# EasyEDA schematic SCH_Trail-Camera_2024-05-14.json
TITLE: Sheet_1; REV: 1.0; Date: 2024-03-28; Sheet: 1/1; Drawn By: thomas37; Company: Your Company
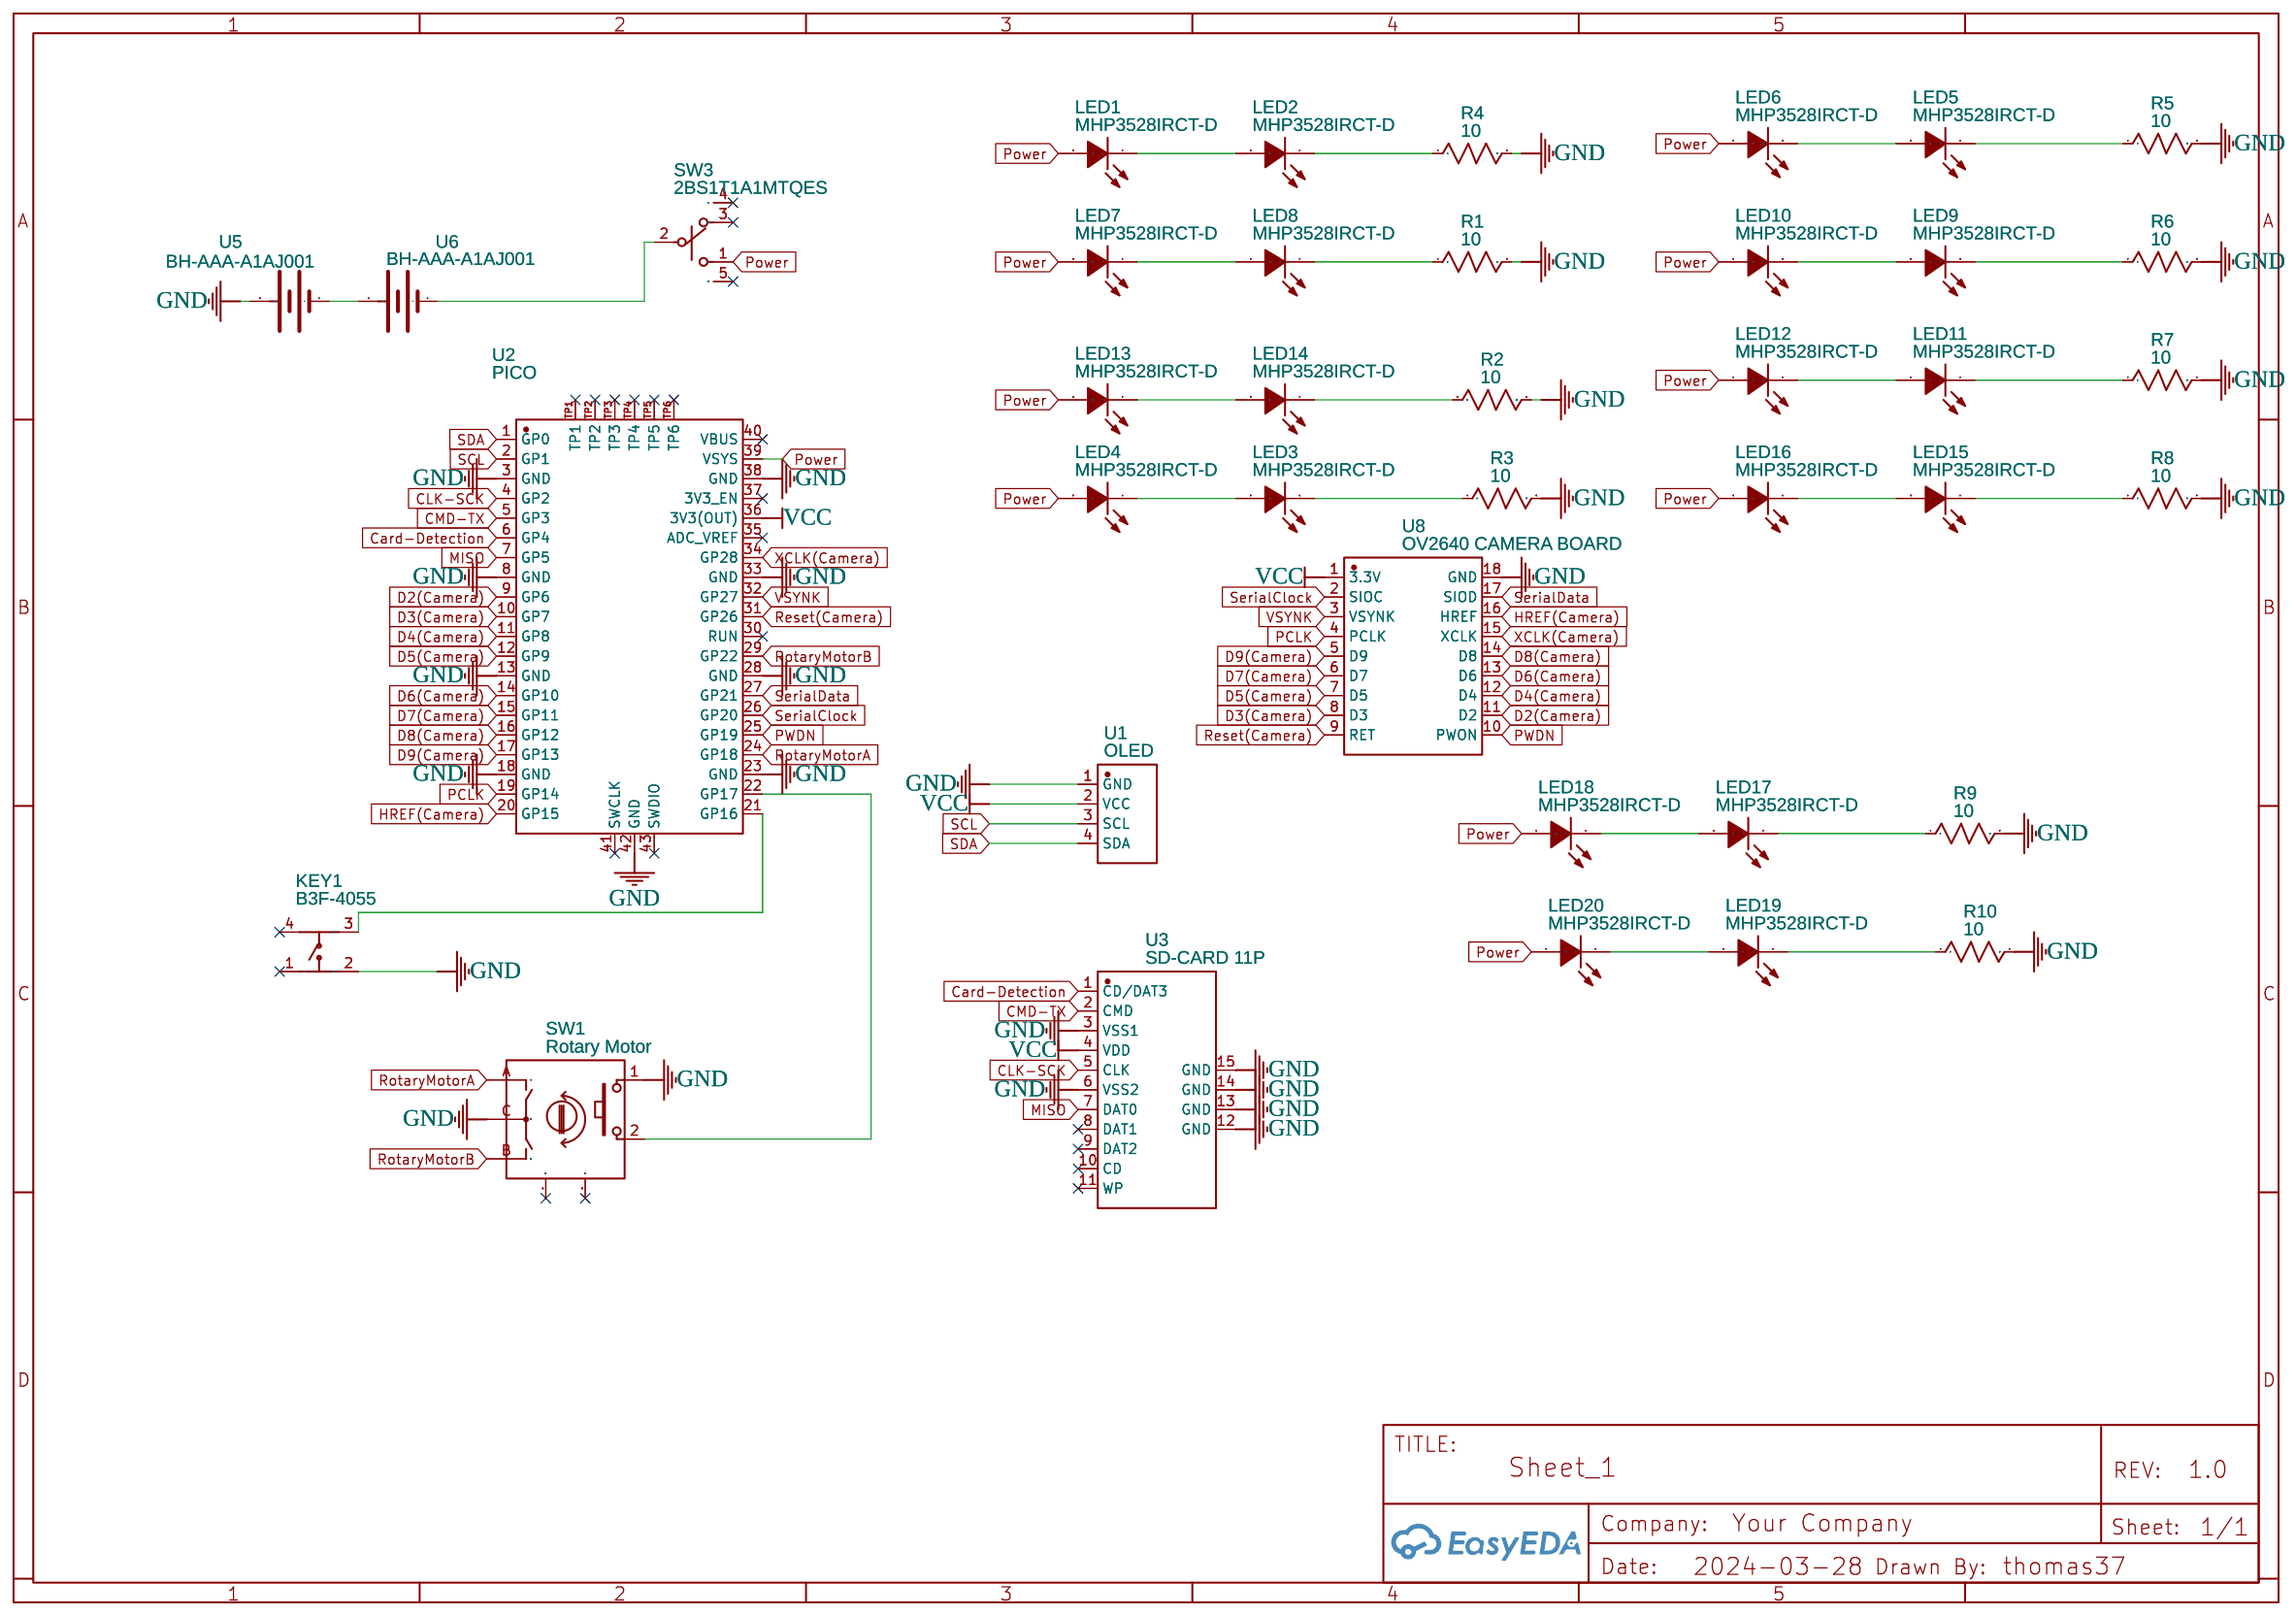
[diagram p0: schematic sheet]

## Parts
KEY1  B3F-4055  [KEY-TH_4P-L12.0-W12.0-P5.00-LS13.4-EH]
LED1  MHP3528IRCT-D  [LED-SMD_L3.2-W2.8-RD]
LED2  MHP3528IRCT-D  [LED-SMD_L3.2-W2.8-RD]
LED3  MHP3528IRCT-D  [LED-SMD_L3.2-W2.8-RD]
LED4  MHP3528IRCT-D  [LED-SMD_L3.2-W2.8-RD]
LED5  MHP3528IRCT-D  [LED-SMD_L3.2-W2.8-RD]
LED6  MHP3528IRCT-D  [LED-SMD_L3.2-W2.8-RD]
LED7  MHP3528IRCT-D  [LED-SMD_L3.2-W2.8-RD]
LED8  MHP3528IRCT-D  [LED-SMD_L3.2-W2.8-RD]
LED9  MHP3528IRCT-D  [LED-SMD_L3.2-W2.8-RD]
LED10  MHP3528IRCT-D  [LED-SMD_L3.2-W2.8-RD]
LED11  MHP3528IRCT-D  [LED-SMD_L3.2-W2.8-RD]
LED12  MHP3528IRCT-D  [LED-SMD_L3.2-W2.8-RD]
LED13  MHP3528IRCT-D  [LED-SMD_L3.2-W2.8-RD]
LED14  MHP3528IRCT-D  [LED-SMD_L3.2-W2.8-RD]
LED15  MHP3528IRCT-D  [LED-SMD_L3.2-W2.8-RD]
LED16  MHP3528IRCT-D  [LED-SMD_L3.2-W2.8-RD]
LED17  MHP3528IRCT-D  [LED-SMD_L3.2-W2.8-RD]
LED18  MHP3528IRCT-D  [LED-SMD_L3.2-W2.8-RD]
LED19  MHP3528IRCT-D  [LED-SMD_L3.2-W2.8-RD]
LED20  MHP3528IRCT-D  [LED-SMD_L3.2-W2.8-RD]
R1  10  [R0603]
R2  10  [R0603]
R3  10  [R0603]
R4  10  [R0603]
R5  10  [R0603]
R6  10  [R0603]
R7  10  [R0603]
R8  10  [R0603]
R9  10  [R0603]
R10  10  [R0603]
SW1  Rotary Motor  [SW-TH_PEC11R-4XXXF-SXXXX]
SW3  2BS1T1A1MTQES  [SW-SMD_2BS1T1A1MTQES]
U1  OLED  [OLED-TH_L27.8-W27.2-P2.54_C9900033791]
U2  PICO  [COMM-SMD_L51.0-W21.0-P2.54_SC0916]
U3  SD-CARD 11P  [SD-CARD-SMD_SD-CARD-11P]
U5  BH-AAA-A1AJ001  [BAT-TH_BH-AAA-A1AJ001]
U6  BH-AAA-A1AJ001  [BAT-TH_BH-AAA-A1AJ001]
U8  OV2640 CAMERA BOARD  [SENSORM-TH_L35.7-W3.9-OV2640]

## Library data of the parts
KEY1 = B3F-4055: Supplier: LCSC; Manufacturer: OMRON(欧姆龙); Supplier Part: C84931; JLCPCB Part Class: Extended Part
LED1-LED20 = MHP3528IRCT-D: Contributor: LCSC; Supplier: LCSC; Supplier Part: C405277; Manufacturer: MEIHUA(美华); JLCPCB Part Class: Extended Part
R1-R10 = R_0603_US: Contributor: LCEDA_Lib
SW1 = PEC11R-4015F-S0024: Contributor: LCSC; Supplier: LCSC; Supplier Part: C143789; Manufacturer: BOURNS; JLCPCB Part Class: Extended Part
SW3 = 2BS1T1A1MTQES: Contributor: LCSC; Supplier: LCSC; Supplier Part: C908286; Manufacturer: Dailywell(德利威); JLCPCB Part Class: Extended Part
U1 = HS96L03W2C03: Contributor: lcsc; Supplier: LCSC; Supplier Part: C5248080; Manufacturer: HS(汉昇); JLCPCB Part Class: Extended Part
U2 = PICO: Supplier: LCSC; Supplier Part: C7203002; Manufacturer: Raspberry Pi(树莓派); JLCPCB Part Class: Extended Part; Contributor: lcsc
U3 = SD-CARD 11P: Supplier: LCSC; Supplier Part: C7529393; Manufacturer: SHOU HAN(首韩); Contributor: lcsc; JLCPCB Part Class: Extended Part
U5 U6 = BH-AAA-A1AJ001: Supplier: LCSC; Supplier Part: C5290189; Manufacturer: MYOUNG(美阳); JLCPCB Part Class: Extended Part; Contributor: lcsc
U8 = OV2640 CAMERA BOARD: Supplier: LCSC; Supplier Part: C359962; Manufacturer: Waveshare(微雪电子); Manufacturer Part: OV2640 Camera Board; Contributor: lcsc

## Nets
GND: KEY1.2 R1.2 R2.2 R3.2 R4.2 R5.2 R6.2 R7.2 R8.2 R9.2 R10.2 SW1.1 SW1.C U1.1(GND) U2.3(GND) U2.8(GND) U2.13(GND) U2.18(GND) U2.23(GND) U2.28(GND) U2.33(GND) U2.38(GND) U2.42(GND) U3.3(VSS1) U3.6(VSS2) U3.12(GND) U3.13(GND) U3.14(GND) U3.15(GND) U5.2(+) U8.18(GND)
VCC: U1.2(VCC) U2.36(3V3(OUT)) U3.4(VDD) U8.1(3.3V)
Card-Detection: U2.6(GP4) U3.1(CD/DAT3)
CLK-SCK: U2.4(GP2) U3.5(CLK)
CMD-TX: U2.5(GP3) U3.2(CMD)
D2(Camera): U2.9(GP6) U8.11(D2)
D3(Camera): U2.10(GP7) U8.8(D3)
D4(Camera): U2.11(GP8) U8.12(D4)
D5(Camera): U2.12(GP9) U8.7(D5)
D6(Camera): U2.14(GP10) U8.13(D6)
D7(Camera): U2.15(GP11) U8.6(D7)
D8(Camera): U2.16(GP12) U8.14(D8)
D9(Camera): U2.17(GP13) U8.5(D9)
HREF(Camera): U2.20(GP15) U8.16(HREF)
MISO: U2.7(GP5) U3.7(DAT0)
PCLK: U2.19(GP14) U8.4(PCLK)
Power: LED1.2(+) LED4.2(+) LED6.2(+) LED7.2(+) LED10.2(+) LED12.2(+) LED13.2(+) LED16.2(+) LED18.2(+) LED20.2(+) SW3.1 U2.39(VSYS)
PWDN: U2.25(GP19) U8.10(PWON)
Reset(Camera): U2.31(GP26) U8.9(RET)
RotaryMotorA: SW1.A U2.24(GP18)
RotaryMotorB: SW1.B U2.29(GP22)
SCL: U1.3(SCL) U2.2(GP1)
SDA: U1.4(SDA) U2.1(GP0)
SerialClock: U2.26(GP20) U8.2(SIOC)
SerialData: U2.27(GP21) U8.17(SIOD)
VSYNK: U2.32(GP27) U8.3(VSYNK)
XCLK(Camera): U2.34(GP28) U8.15(XCLK)
Net-(KEY1-3): KEY1.3 U2.21(GP16)
Net-(LED1-1): LED1.1(-) LED2.2(+)
Net-(LED2-1): LED2.1(-) R4.1
Net-(LED3-1): LED3.1(-) R3.1
Net-(LED3-2): LED3.2(+) LED4.1(-)
Net-(LED5-1): LED5.1(-) R5.1
Net-(LED5-2): LED5.2(+) LED6.1(-)
Net-(LED7-1): LED7.1(-) LED8.2(+)
Net-(LED8-1): LED8.1(-) R1.1
Net-(LED9-1): LED9.1(-) R6.1
Net-(LED9-2): LED9.2(+) LED10.1(-)
Net-(LED11-1): LED11.1(-) R7.1
Net-(LED11-2): LED11.2(+) LED12.1(-)
Net-(LED13-1): LED13.1(-) LED14.2(+)
Net-(LED14-1): LED14.1(-) R2.1
Net-(LED15-1): LED15.1(-) R8.1
Net-(LED15-2): LED15.2(+) LED16.1(-)
Net-(LED17-1): LED17.1(-) R9.1
Net-(LED17-2): LED17.2(+) LED18.1(-)
Net-(LED19-1): LED19.1(-) R10.1
Net-(LED19-2): LED19.2(+) LED20.1(-)
Net-(SW1-2): SW1.2 U2.22(GP17)
Net-(SW3-2): SW3.2 U6.1(-)
Net-(U5-1): U5.1(-) U6.2(+)

Not connected (* = marked no-connect by the designer): KEY1 1* 4*; SW1 MT1* MT2*; SW3 3* 4* 5*; U2 30(RUN)* 35(ADC_VREF)* 37(3V3_EN)* 40(VBUS)* 41(SWCLK)* 43(SWDIO)* TP1* TP2* TP3* TP4* TP5* TP6*; U3 8(DAT1)* 9(DAT2)* 10(CD)* 11(WP)*
